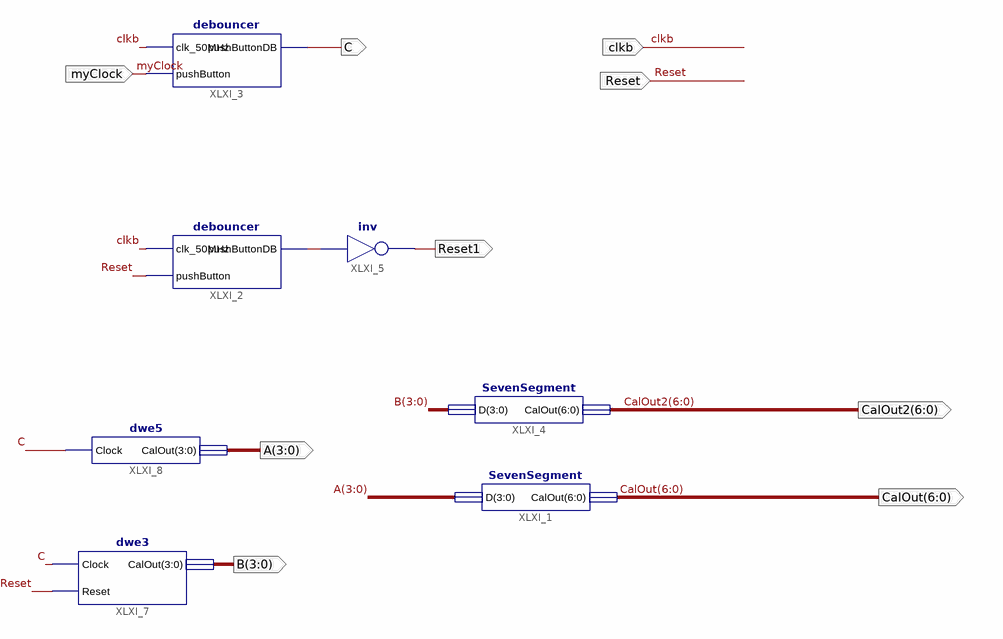
[diagram p0: schematic sheet 1]
// Xilinx ISE schematic top.sch (spartan3) as structural Verilog: 7 symbols, 9 ports
module top (
  input  clkb,
  input  myClock,
  input  Reset,
  output [3:0] A,
  output [6:0] CalOut,
  output C,
  output Reset1,
  output [3:0] B,
  output [6:0] CalOut2
);

  wire XLXN_8;

  SevenSegment XLXI_1 (.D(A), .CalOut(CalOut));
  debouncer XLXI_2 (.clk_50MHz(clkb), .pushButton(Reset), .pushButtonDB(XLXN_8));
  debouncer XLXI_3 (.clk_50MHz(clkb), .pushButton(myClock), .pushButtonDB(C));
  SevenSegment XLXI_4 (.D(B), .CalOut(CalOut2));
  not XLXI_5 (Reset1, XLXN_8);
  dwe3 XLXI_7 (.CalOut(B), .Clock(C), .Reset(Reset));
  dwe5 XLXI_8 (.CalOut(A), .Clock(C));

  // Notes on the sheet:
  //   LOC on signal CalOut(6:0) = J14,J15,H14,H15,G16,J13,M15
  //   LOC on signal clkb = P8
  //   LOC on signal myClock = E11
  //   LOC on signal Reset = A13
  //   LOC on signal CalOut2(6:0) = N3,N1,L5,M4,M3,P1,N2
endmodule
